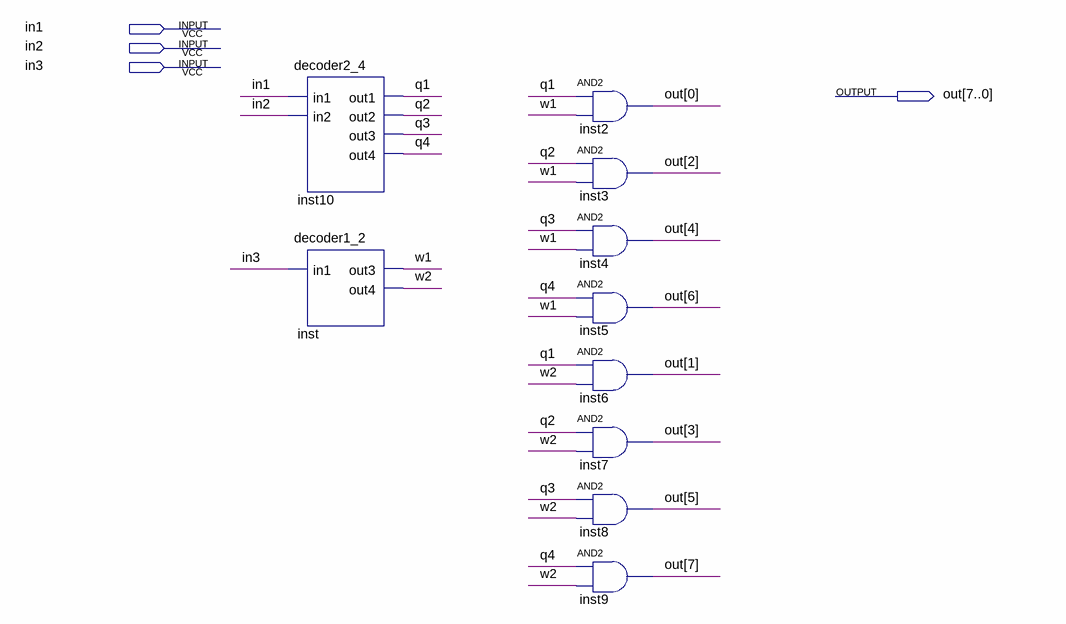
[diagram p0: schematic sheet]
// Quartus schematic decoder3_8.bdf as structural Verilog: 10 symbols, 4 pins
module decoder3_8 (
  input  in1,
  input  in2,
  input  in3,
  output [7:0] out
);

  wire q1, q2, q3, q4, w1, w2;

  decoder2_4 inst10 (.in1(in1), .in2(in2), .out1(q1), .out2(q2), .out3(q3), .out4(q4));
  decoder1_2 inst (.in1(in3), .out3(w1), .out4(w2));
  and inst2 (out[0], q1, w1);
  and inst3 (out[2], q2, w1);
  and inst4 (out[4], q3, w1);
  and inst5 (out[6], q4, w1);
  and inst6 (out[1], q1, w2);
  and inst7 (out[3], q2, w2);
  and inst8 (out[5], q3, w2);
  and inst9 (out[7], q4, w2);
endmodule
